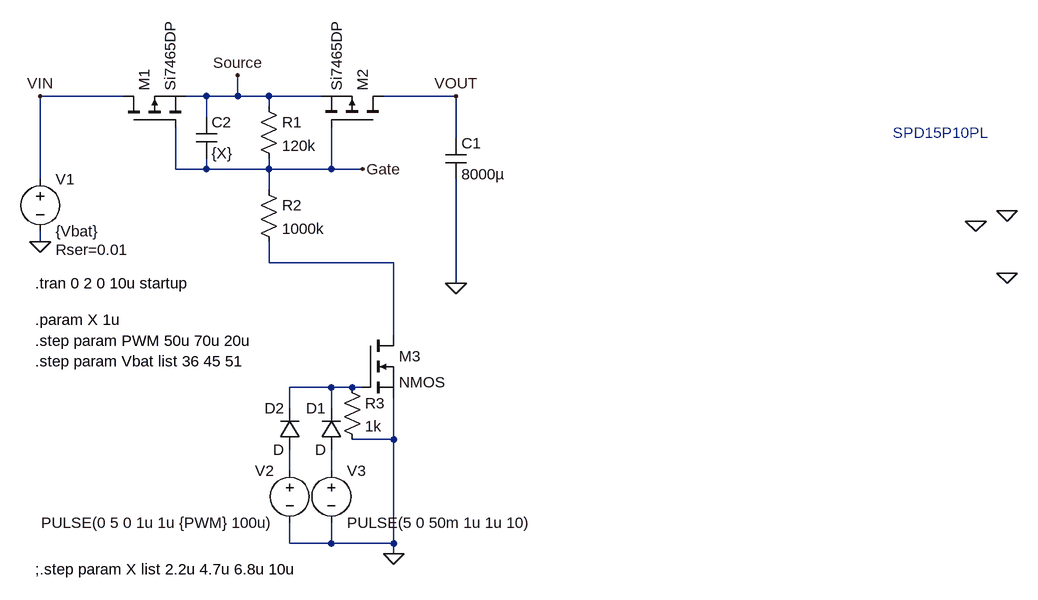
[diagram p0: schematic Pre-Charge FET.asc]
Pre-Charge FET.asc, the LTspice schematic file:
Version 4.1
SHEET 1 1272 680
WIRE -272 -160 -400 -160
WIRE -144 -160 -176 -160
WIRE -96 -160 -96 -192
WIRE -96 -160 -144 -160
WIRE -48 -160 -96 -160
WIRE 32 -160 -48 -160
WIRE 240 -160 128 -160
WIRE -48 -144 -48 -160
WIRE -144 -128 -144 -160
WIRE 240 -96 240 -160
WIRE -192 -48 -192 -112
WIRE -144 -48 -144 -64
WIRE -144 -48 -192 -48
WIRE -48 -48 -48 -64
WIRE -48 -48 -144 -48
WIRE 48 -48 48 -112
WIRE 48 -48 -48 -48
WIRE 96 -48 48 -48
WIRE -400 -32 -400 -160
WIRE -48 -16 -48 -48
WIRE -400 64 -400 48
WIRE -48 96 -48 64
WIRE 144 96 -48 96
WIRE 240 128 240 -32
WIRE 144 208 144 96
WIRE 48 288 -16 288
WIRE 80 288 48 288
WIRE 96 288 80 288
WIRE -16 320 -16 288
WIRE 48 320 48 288
WIRE 144 368 144 304
WIRE 144 368 80 368
WIRE -16 416 -16 384
WIRE 48 416 48 384
WIRE -16 528 -16 496
WIRE 48 528 48 496
WIRE 48 528 -16 528
WIRE 144 528 144 368
WIRE 144 528 48 528
WIRE 144 544 144 528
FLAG 240 128 0
FLAG -400 64 0
FLAG 1088 112 0
FLAG 1088 16 0
FLAG 1040 32 0
FLAG -400 -160 VIN
FLAG 240 -160 VOUT
FLAG -96 -192 Source
FLAG 96 -48 Gate
FLAG 144 544 0
SYMBOL cap 224 -96 R0
SYMATTR Value 8000µ
SYMATTR InstName C1
SYMATTR SpiceLine V=63 Irms=50 Rser=0.001 Lser=0
SYMBOL pmos 128 -112 M270
SYMATTR InstName M2
SYMATTR Value Si7465DP
SYMBOL voltage -400 -48 R0
WINDOW 123 0 0 Left 0
WINDOW 39 24 124 Left 2
SYMATTR InstName V1
SYMATTR Value {Vbat}
SYMATTR SpiceLine Rser=0.01
SYMBOL res -64 -160 R0
SYMATTR InstName R1
SYMATTR Value 120k
SYMBOL cap -160 -128 R0
SYMATTR InstName C2
SYMATTR Value {X}
SYMBOL res -64 -32 R0
SYMATTR InstName R2
SYMATTR Value 1000k
SYMBOL pmos -272 -112 R270
SYMATTR InstName M1
SYMATTR Value Si7465DP
SYMBOL voltage -16 400 M0
WINDOW 123 0 0 Left 0
WINDOW 39 0 0 Left 0
SYMATTR InstName V2
SYMATTR Value PULSE(0 5 0 1u 1u {PWM} 100u)
SYMBOL nmos 96 208 R0
SYMATTR InstName M3
SYMBOL voltage 48 400 R0
WINDOW 123 0 0 Left 0
WINDOW 39 0 0 Left 0
SYMATTR InstName V3
SYMATTR Value PULSE(5 0 50m 1u 1u 10)
SYMBOL diode 64 384 R180
WINDOW 0 24 64 Left 2
WINDOW 3 24 0 Left 2
SYMATTR InstName D1
SYMBOL diode 0 384 R180
WINDOW 0 24 64 Left 2
WINDOW 3 24 0 Left 2
SYMATTR InstName D2
SYMBOL res 64 272 R0
SYMATTR InstName R3
SYMATTR Value 1k
TEXT -408 128 Left 2 !.tran 0 2 0 10u startup
TEXT 912 -104 Left 2 ;SPD15P10PL
TEXT -408 568 Left 2 !;.step param X list 2.2u 4.7u 6.8u 10u
TEXT -408 184 Left 2 !.param X 1u
TEXT -408 216 Left 2 !.step param PWM 50u 70u 20u
TEXT -408 248 Left 2 !.step param Vbat list 36 45 51

The netlist it stands for:
* Pre-Charge FET.asc
C1 VOUT 0 8000µ V=63 Irms=50 Rser=0.001 Lser=0
M2 VOUT Gate Source Source Si7465DP
V1 VIN 0 {Vbat} Rser=0.01
R1 Source Gate 120k
C2 Source Gate {X}
R2 Gate N001 1000k
M1 VIN Gate Source Source Si7465DP
V2 N003 0 PULSE(0 5 0 1u 1u {PWM} 100u)
M3 N001 N002 0 0 NMOS
V3 N004 0 PULSE(5 0 50m 1u 1u 10)
D1 N004 N002 D
D2 N003 N002 D
R3 N002 0 1k
.model D D
.lib standard.dio
.model NMOS NMOS
.model PMOS PMOS
.lib standard.mos
.tran 0 2 0 10u startup
* SPD15P10PL
;.step param X list 2.2u 4.7u 6.8u 10u
.param X 1u
.step param PWM 50u 70u 20u
.step param Vbat list 36 45 51
.backanno
.end